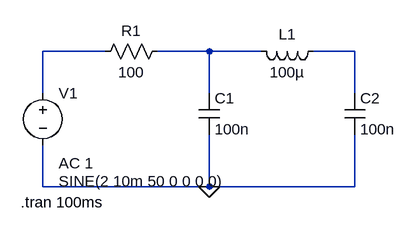
[diagram p0: schematic PI_filter_ripple_voltage.asc]
PI_filter_ripple_voltage.asc, the LTspice schematic file:
Version 4
SHEET 1 880 680
WIRE -96 128 -192 128
WIRE 64 128 -16 128
WIRE 144 128 64 128
WIRE 288 128 224 128
WIRE -192 192 -192 128
WIRE 64 192 64 128
WIRE 288 192 288 128
WIRE -192 336 -192 272
WIRE 64 336 64 256
WIRE 64 336 -192 336
WIRE 288 336 288 256
WIRE 288 336 64 336
FLAG 64 336 0
SYMBOL ind 240 112 R90
WINDOW 0 5 56 VBottom 2
WINDOW 3 32 56 VTop 2
SYMATTR InstName L1
SYMATTR Value 100µ
SYMBOL cap 48 192 R0
SYMATTR InstName C1
SYMATTR Value 100n
SYMBOL cap 272 192 R0
SYMATTR InstName C2
SYMATTR Value 100n
SYMBOL res 0 112 R90
WINDOW 0 0 56 VBottom 2
WINDOW 3 32 56 VTop 2
SYMATTR InstName R1
SYMATTR Value 100
SYMBOL voltage -192 176 R0
WINDOW 3 24 152 Left 2
WINDOW 123 24 124 Left 2
WINDOW 39 0 0 Left 0
SYMATTR InstName V1
SYMATTR Value SINE(2 10m 50 0 0 0 0)
SYMATTR Value2 AC 1
TEXT -226 360 Left 2 !.tran 100ms

The netlist it stands for:
* PI_filter_ripple_voltage.asc
L1 N003 N002 100µ
C1 N002 0 100n
C2 N003 0 100n
R1 N002 N001 100
V1 N001 0 SINE(2 10m 50 0 0 0 0) AC 1
.tran 100ms
.backanno
.end